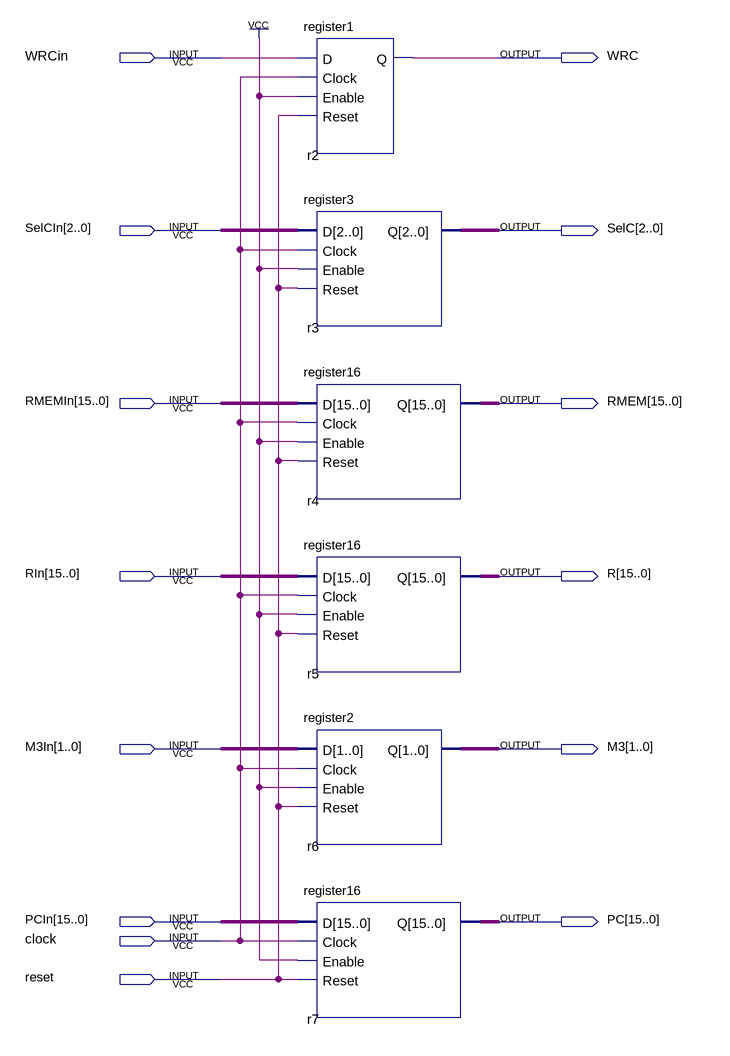
[diagram p0: schematic sheet]
// Quartus schematic pipeline3.bdf as structural Verilog: 6 symbols, 14 pins
module pipeline3 (
  input  WRCin,
  input  [2:0] SelCIn,
  input  [15:0] RMEMIn,
  input  [15:0] RIn,
  input  [1:0] M3In,
  input  [15:0] PCIn,
  input  clock,
  input  reset,
  output WRC,
  output [2:0] SelC,
  output [15:0] RMEM,
  output [15:0] R,
  output [1:0] M3,
  output [15:0] PC
);

  register1 r2 (.D(WRCin), .Clock(clock), .Enable(1'b1), .Reset(reset), .Q(WRC));
  register3 r3 (.D(SelCIn), .Clock(clock), .Enable(1'b1), .Reset(reset), .Q(SelC));
  register16 r4 (.D(RMEMIn), .Clock(clock), .Enable(1'b1), .Reset(reset), .Q(RMEM));
  register16 r5 (.D(RIn), .Clock(clock), .Enable(1'b1), .Reset(reset), .Q(R));
  register2 r6 (.D(M3In), .Clock(clock), .Enable(1'b1), .Reset(reset), .Q(M3));
  register16 r7 (.D(PCIn), .Clock(clock), .Enable(1'b1), .Reset(reset), .Q(PC));
endmodule
